# EasyEDA schematic SHC.json
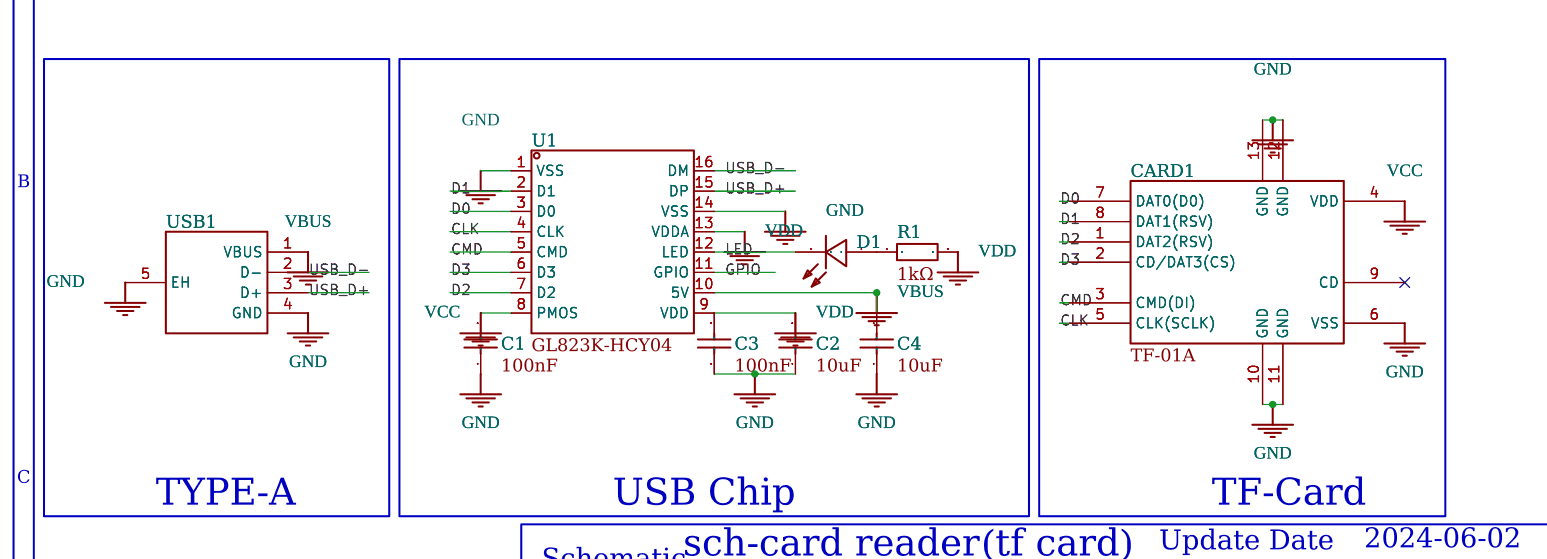
[diagram p0: schematic sheet]

## Parts
C1  100nF  [0]
C2  10uF  [0]
C3  100nF  [0]
C4  10uF  [0]
CARD1  TF-01A  [0]
D1  KT-0805翠绿  [0]
R1  1kΩ  [0]
U1  GL823K-HCY04  [0]
USB1  AM 180°  [0]

## Library data of the parts
C1 C3 = -: 容值:100nF;精度:±10%;额定电压:100V;材质(温度系数):X7R;; Symbol: CL21B104KCFNNNE; Device: CL21B104KCFNNNE; LCSC Part Name: 100nF ±10% 100V; Supplier Part: C28233; Manufacturer: SAMSUNG(三星); Manufacturer Part: CL21B104KCFNNNE; Supplier Footprint: 0805; Datasheet: https://atta.szlcsc.com/upload/public/pdf/source/20160103/1457707716102.pdf; Supplier: LCSC; Add into BOM: yes; Convert to PCB: yes; Tolerance: ±10%; Voltage Rated: 100V; Temperature Coefficient: X7R
C2 C4 = -: 容值:10uF;精度:±10%;额定电压:25V;材质(温度系数):X5R;; Symbol: CL21A106KAYNNNE; Device: CL21A106KAYNNNE_C15850; LCSC Part Name: 10uF ±10% 25V; Supplier Part: C15850; Manufacturer: SAMSUNG(三星); Manufacturer Part: CL21A106KAYNNNE; Supplier Footprint: 0805; Datasheet: https://atta.szlcsc.com/upload/public/pdf/source/20160103/1457707679302.pdf; Supplier: LCSC; Add into BOM: yes; Convert to PCB: yes; Tolerance: ±10%; Voltage Rated: 25V; Temperature Coefficient: X5R
CARD1 = -: 工作温度范围:-;本体最大高度:-;触头镀层:-;连接器类型:卡座;卡类型:MicroSD卡(TF卡);焊接温度(最大值):-;触头材质:-;卡连接方式:自弹式;; Device: TF-01A_C91145; Supplier Part: C91145; Manufacturer: 韩国韩荣; Supplier Footprint: SMD; JLCPCB Part Class: 扩展库; Datasheet: https://atta.szlcsc.com/upload/public/pdf/source/20190322/C91145_63CBD6FB4639A3A3EC6A9721F18AE0FB.pdf; Supplier: LCSC; Add into BOM: yes; Convert to PCB: yes; Connector Type: 卡座; Card Type: MicroSD卡(TF卡); Card Connection Mode: 自弹式
D1 = -: 发光颜色:翠绿;二极管配置:-;主波长:-;色温:-;光通量(25℃时):-;发光强度:-;功率:-;安装方式:-;; Symbol: 0805G (Green); LCSC Part Name: 0805翠绿（250-300mcd); Supplier Part: C2297; Manufacturer: KENTO; Supplier Footprint: 0805; Datasheet: https://atta.szlcsc.com/upload/public/pdf/source/20170209/1486607340485.pdf; Supplier: LCSC; Add into BOM: yes; Convert to PCB: yes; Emitted Color: 翠绿
R1 = -: 电阻类型:厚膜电阻;阻值:1kΩ;精度:±1%;功率:125mW;; Symbol: 0805W8F1001T5E; Device: 0805W8F1001T5E; LCSC Part Name: 1kΩ ±1% 125mW; Supplier Part: C17513; Manufacturer: UNI-ROYAL(厚声); Manufacturer Part: 0805W8F1001T5E; Supplier Footprint: 0805; Datasheet: https://atta.szlcsc.com/upload/public/pdf/source/20200306/C422600_1E6D84923E4A46A82E41ADD87F860B5C.pdf; Supplier: LCSC; Add into BOM: yes; Convert to PCB: yes; Type: 厚膜电阻; Tolerance: ±1%; Power(Watts): 125mW; Temperature Coefficient: ±100ppm/℃; Overload Voltage (Max): 150V; Operating Temperature Range: -55℃+155℃
U1 = -: 类型:-;协议类别:-;驱动器/接收器数:-;数据速率:-;; Supplier Part: C284879; Manufacturer: GENESYS(创惟); Supplier Footprint: SSOP-16; JLCPCB Part Class: 扩展库; Datasheet: https://atta.szlcsc.com/upload/public/pdf/source/20190212/C284879_D3054E8AA735401C3047DCECFFFED6D3.pdf; Supplier: LCSC; Add into BOM: yes; Convert to PCB: yes
USB1 = -: 连接器类型:Type-A;标准:USB 2.0;公母:公头;触点数量:4;端口数量:1;安装方式:卧贴;额定电流 - 电源:1A;工作温度范围:-40℃+60℃;; LCSC Part Name: Type-A 公头 卧贴 白胶有柱 直边; Supplier Part: C2681564; Manufacturer: SHOU HAN(首韩); Supplier Footprint: SMD; Datasheet: https://atta.szlcsc.com/upload/public/pdf/source/20210107/C2681564_25DA62A2D5638CEDBC3A14F60B11E72F.pdf; Supplier: LCSC; Add into BOM: yes; Convert to PCB: yes; Connector Type: Type-A; Standard: USB 2.0; Gender: 公头; Number of Contacts: 4; Number of Ports: 1; Mounting Style: 卧贴; Current Rating - Power (Max): 1A; Operating Temperature Range: -40℃+60℃

## Nets
GND: C1.1 C2.1 C3.1 C4.1 CARD1.6(VSS) CARD1.10(GND) CARD1.11(GND) CARD1.12(GND) CARD1.13(GND) U1.1(VSS) U1.14(VSS) USB1.4(GND) USB1.5(EH)
VBUS: C4.2 U1.10(5V) USB1.1(VBUS)
VCC: C1.2 CARD1.4(VDD) U1.8(PMOS)
VDD: C2.2 C3.2 R1.2 U1.9(VDD) U1.13(VDDA)
CLK: CARD1.5(CLK(SCLK)) U1.4(CLK)
CMD: CARD1.3(CMD(DI)) U1.5(CMD)
D0: CARD1.7(DAT0(D0)) U1.3(D0)
D1: CARD1.8(DAT1(RSV)) U1.2(D1)
D2: CARD1.1(DAT2(RSV)) U1.7(D2)
D3: CARD1.2(CD/DAT3(CS)) U1.6(D3)
GPIO: U1.11(GPIO)
LED: D1.2(K) U1.12(LED)
USB_D+: U1.15(DP) USB1.3(D+)
USB_D-: U1.16(DM) USB1.2(D-)
Net-(D1-1): D1.1(A) R1.1

Not connected (* = marked no-connect by the designer): CARD1 9(CD)*

## Notes on the sheet
- 1
- 2
- 3
- 4
- 5
- 6
- A
- A
- B
- B
- C
- TYPE-A
- USB Chip
- TF-Card
- C
- sch-card reader(tf card)
- Update Date
- 2024-06-02
- Schematic
- Create Date
- 2024-06-02
- Page
- Part Number
- N/A
- Drawn
- TF Card Edition
- Reviewed
- D
- VER
- SIZE
- PAGE
- 1
- OF
- 1
- D
- V0.7
- A5
- 1
- 2
- 3
- 4
- 5
- 6
